# EAGLE design IRKitESP8266_v11 (EAGLE 8.4.3)
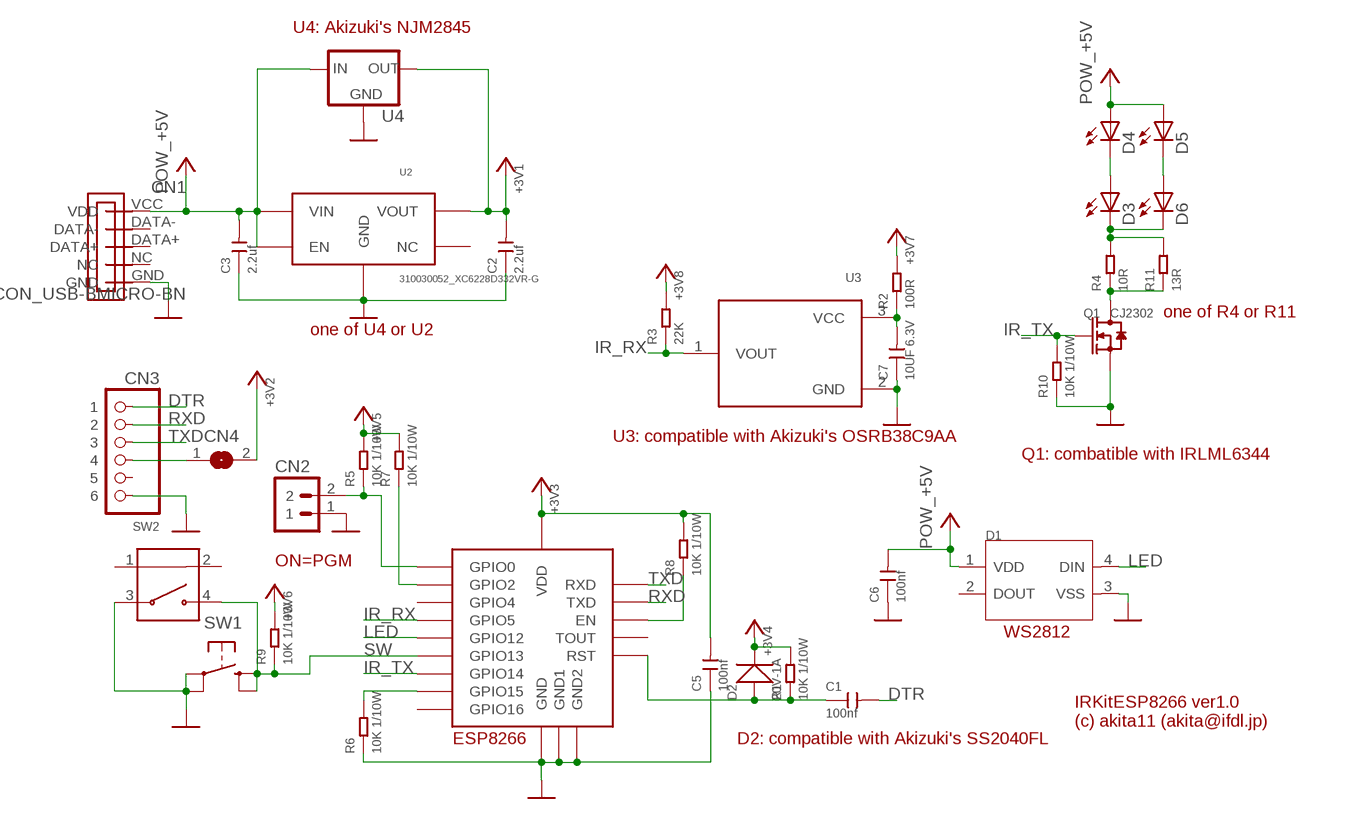
[diagram p0: schematic, sheet 1]

## Parts
C1  100nf  CERAMIC-100NF-50V-10%-X7R(0603)  [C0603]
C2  2.2uf  CERAMIC-2.2UF-10V-10%-X7R(0603)  [C0603]
C3  2.2uf  CERAMIC-2.2UF-10V-10%-X7R(0603)  [C0603]
C5  100nf  CERAMIC-100NF-50V-10%-X7R(0603)  [C0603]
C6  100nf  CERAMIC-100NF-50V-10%-X7R(0603)  [C0603]
C7  10UF 6.3V  CERAMIC-10UF-6.3V-20%-X5R(0603)  [C0603]
CN1  CON_USB-BMICRO-BN  [MICRO-USB_B_NARROW]
CN2  CON_PINHD-1X2PTH  [SPARKFUN_1X02]
CN3  CON_PINHD-1X6  [1X06]
CN4  JUMPER_SJ  [JUMPER_SJ]
D1  SMD-RGB-LED-4P'WS2812B'  [LED4-SMD-5050]
D2  20V-1A  SMD-DIODE-SCHOTTKY-20V-1A(SOD-123)  [SOD-123]
D3  LED5MM  [SPARKFUN_LED5MM]
D4  LED5MM  [SPARKFUN_LED5MM]
D5  LED5MM  [SPARKFUN_LED5MM]
D6  LED5MM  [SPARKFUN_LED5MM]
Q1  CJ2302  SMD-MOSFET-N-CH-20V-2.1A-CJ2302(SOT-23)  [SOT-23]
R1  10K 1/10W  SMD-RES-10K-5%-1/10W(0603)  [R0603]
R2  100R  SMD-RES-100R-5%-1/10W(0603)  [R0603]
R3  22K  SMD-RES-22K-5%-1/10W(0603)  [R0603]
R4  10R  SMD-RES-10R-1%-1/10W(0603)  [R0603]
R5  10K 1/10W  SMD-RES-10K-5%-1/10W(0603)  [R0603]
R6  10K 1/10W  SMD-RES-10K-5%-1/10W(0603)  [R0603]
R7  10K 1/10W  SMD-RES-10K-5%-1/10W(0603)  [R0603]
R8  10K 1/10W  SMD-RES-10K-5%-1/10W(0603)  [R0603]
R9  10K 1/10W  SMD-RES-10K-5%-1/10W(0603)  [R0603]
R10  10K 1/10W  SMD-RES-10K-5%-1/10W(0603)  [R0603]
R11  13R  SMD-RES-13R-5%-1/4W(1206)  [R1206]
SW1  SW_TACTTH  [SW_B3F-10XX]
SW2  TS-1188E  [TS-1188E]
U1  MOD_ESP8266WROOM02  [MOD_ESP8266WROOM02]
U2  310030052_XC6228D332VR-G  [SOT25J]
U3  TSOP382  [TSOP382]
U4  REG_78XXTO252-3  [TO-252-3]

## Nets
+3V3: C2.2 C5.2 CN4.2 D2.- R1.2 R2.2 R3.2 R5.2 R7.2 R8.2 R9.2 U1.P$1(VDD) U2.P$5(VOUT) U4.P$3(OUT) ; supply symbol labelled POW_+3V3
+5V: C3.2 C6.2 CN1.VCC(VDD) D1.1(VDD) D4.A D5.A U2.P$1(VIN) U2.P$3(EN) U4.P$1(IN) ; supply symbol labelled POW_+5V
DTR: C1.2 CN3.1
GND: C2.1 C3.1 C5.1 C6.1 C7.1 CN1.GND CN2.1 CN3.6 D1.3(VSS) Q1.2(S) R6.1 R10.1 SW1.3(P) SW1.4(P1) SW2.3 U1.P$9(GND) U1.P$13(GND1) U1.P$18(GND2) U2.P$2(GND) U3.2(GND) U4.P$2(GND) ; supply symbol labelled POW_GND
IR_RX: R3.1 U1.P$14(GPIO5) U3.1(VOUT)
IR_TX: Q1.1(G) R10.2 U1.P$3(GPIO14)
LED: D1.4(DIN) U1.P$4(GPIO12)
N$1: C1.1 D2.+ R1.1 U1.P$15(RST)
N$2: R6.2 U1.P$6(GPIO15)
N$3: CN2.2 R5.1 U1.P$8(GPIO0)
N$4: R7.1 U1.P$7(GPIO2)
N$5: CN3.4 CN4.1
N$6: R8.1 U1.P$2(EN)
N$7: C7.2 R2.1 U3.3(VCC)
N$9: Q1.3(D) R4.1 R11.1
N$10: D3.K(C) D6.K(C) R4.2 R11.2
N$11: D3.A D4.K(C)
N$12: D5.K(C) D6.A
RXD: CN3.2 U1.P$12(TXD)
SW: R9.1 SW1.1(S) SW1.2(S1) SW2.4 U1.P$5(GPIO13)
TXD: CN3.3 U1.P$11(RXD)
Unconnected: CN1.DATA+ CN1.DATA- CN1.NC CN3.5 D1.2(DOUT) SW2.1 SW2.2 U1.P$10(GPIO4) U1.P$16(TOUT) U1.P$17(GPIO16) U2.P$4(NC)

## Notes on the sheet
- U4: Akizuki's NJM2845
- one of R4 or R11
- one of U4 or U2
- U3: compatible with Akizuki's OSRB38C9AA
- Q1: combatible with IRLML6344
- ON=PGM
- WS2812
- IRKitESP8266 ver1.0
  (c) akita11 (akita@ifdl.jp)
- ESP8266 | D2: compatible with Akizuki's SS2040FL

## Library data of the parts
C1 C5 C6 = Seeed-Capacitor-2016:CERAMIC-100NF-50V-10%-X7R(0603): 302010138; MPN: CC0603KRX7R9BB104
C2 C3 = Seeed-Capacitor-2016:CERAMIC-2.2UF-10V-10%-X7R(0603): 302010054; MPN: CC0603KRX7R6BB225
C7 = Seeed-Capacitor-2016:CERAMIC-10UF-6.3V-20%-X5R(0603): 302010286; MPN: CC0603MRX5R5BB106
CN1 = akita:CON_USB-B
CN2 = akita:CON_PINHD-1X2: Header 2 Standard 2-pin 0.1" header. Use with straight break away headers (SKU : PRT-00116), right angle break away headers (PRT-00553), swiss pins (PRT-00743), machine pins (PRT-00117), and female headers (PRT-00115). Molex polarized connector foot print use with SKU : PRT-08233 with associated crimp pins and housings.
CN3 = akita:CON_PINHD-1X6: PIN HEADER
CN4 = akita:JUMPER_SJ: SMD solder JUMPER
D1 = Seeed-Diode-2016:SMD-RGB-LED-4P: 304990003
D2 = Seeed-Diode-2016:SMD-DIODE-SCHOTTKY-20V-1A(SOD-123): 304020034; MPN: B5819W
D3-D6 = akita:LED: LEDs Standard schematic elements and footprints for 5mm, 3mm, 1206, and 0603 sized LEDs. 5mm - Spark Fun Electronics SKU : COM-00529 (and others)
Q1 = Seeed-Transistor-2016:SMD-MOSFET-N-CH-20V-2.1A-CJ2302(SOT-23): 305030015; MPN: CJ2302
R1 R5-R10 = Seeed-Resistor-2016:SMD-RES-10K-5%-1/10W(0603): 301010293; MPN: RC0603JR-0710KL
R2 = Seeed-Resistor-2016:SMD-RES-100R-5%-1/10W(0603): 301010090; MPN: RC0603JR-07100RL
R3 = Seeed-Resistor-2016:SMD-RES-22K-5%-1/10W(0603): 301010132; MPN: RC0603JR-0722KL
R4 = Seeed-Resistor-2016:SMD-RES-10R-1%-1/10W(0603): 301010185; MPN: RC0603FR-0710RL
R11 = Seeed-Resistor-2016:SMD-RES-13R-5%-1/4W(1206): 301010405; MPN: RC1206JR-0713RL
SW1 = akita:SW_TACT: OMRON SWITCH; MPN: B3F-1000; OC_FARNELL: 176432; OC_NEWARK: 36M3542
SW2 = Seeed-OPL-2017-01-Switch-camilo:TS-1188E: 311020023
U1 = akita:MOD_ESP8266WROOM02
U2 = Seeed-OPL-2017-01-IC:310030052_XC6228D332VR-G: Torex;XC6228D332VR-G, SMD IC PMIC;SOT-25J, SKU: 310030052
U3 = Seeed-OPL-2017-01-Sensor-camilo:TSOP382: 314020013
U4 = akita:REG_78XX: Voltage Regulator Standard 7805 5V regulator. IGO (Input Ground Output). Spark Fun Electronics SKU : COM-00107

## Board
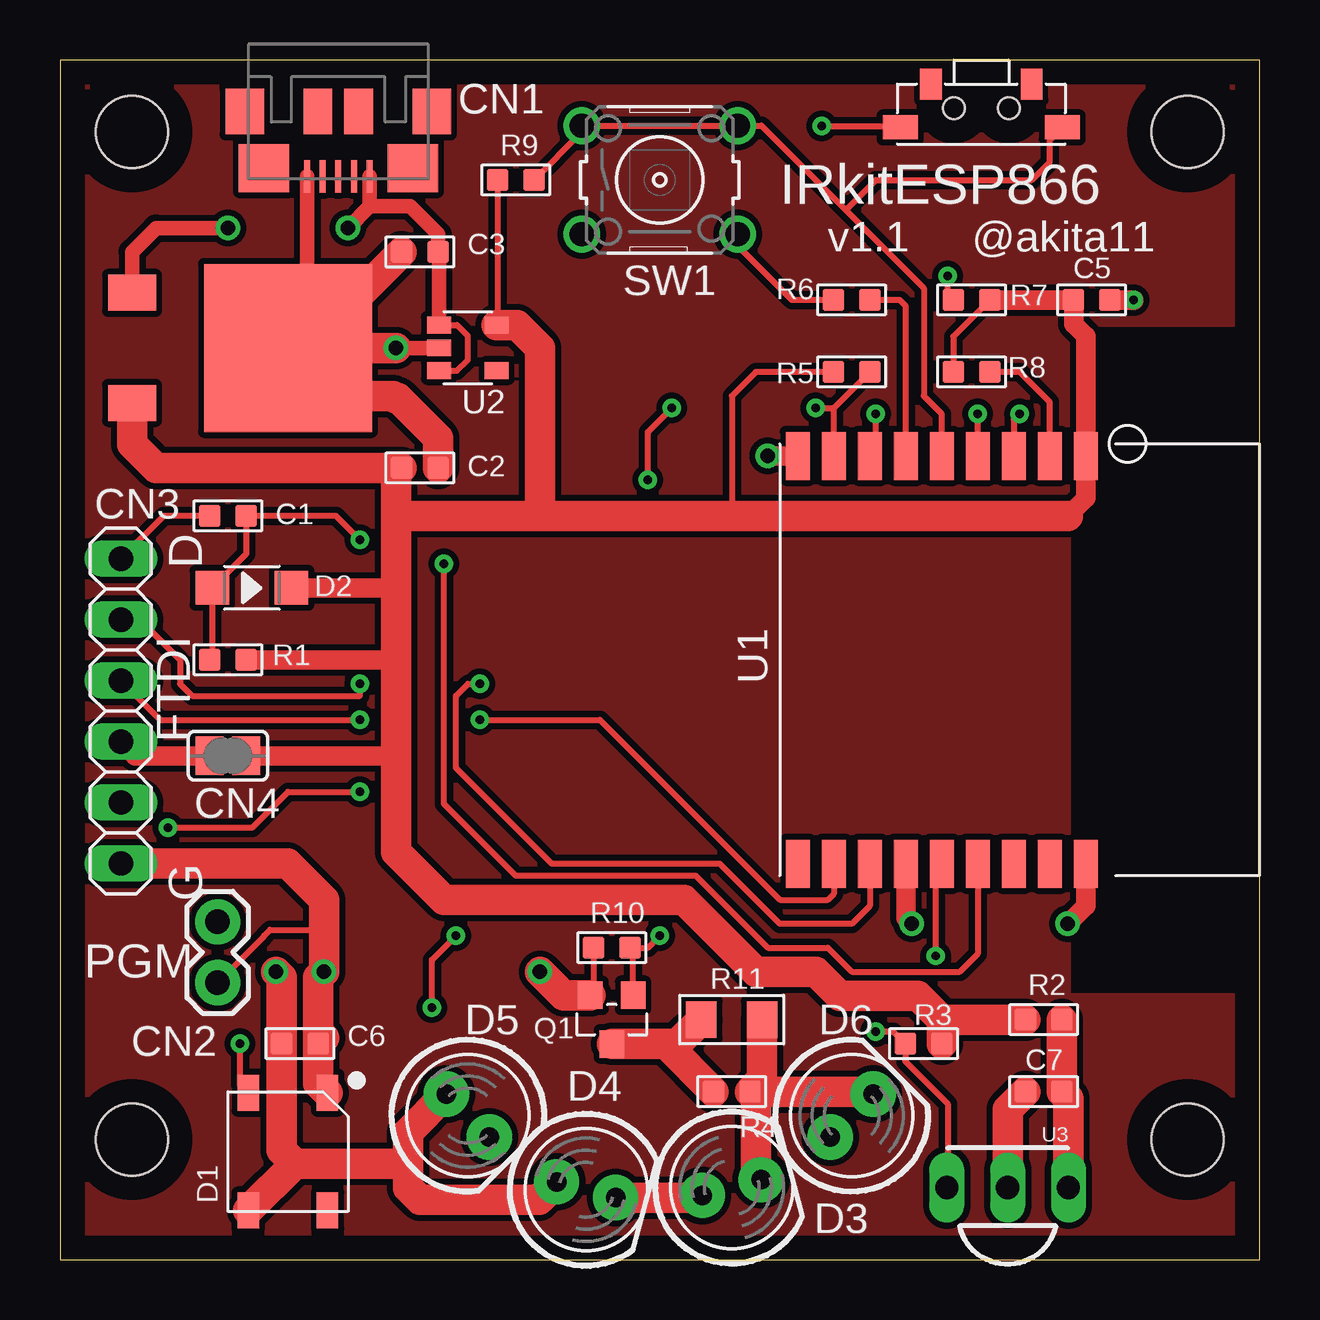
[diagram p1: board, top side]
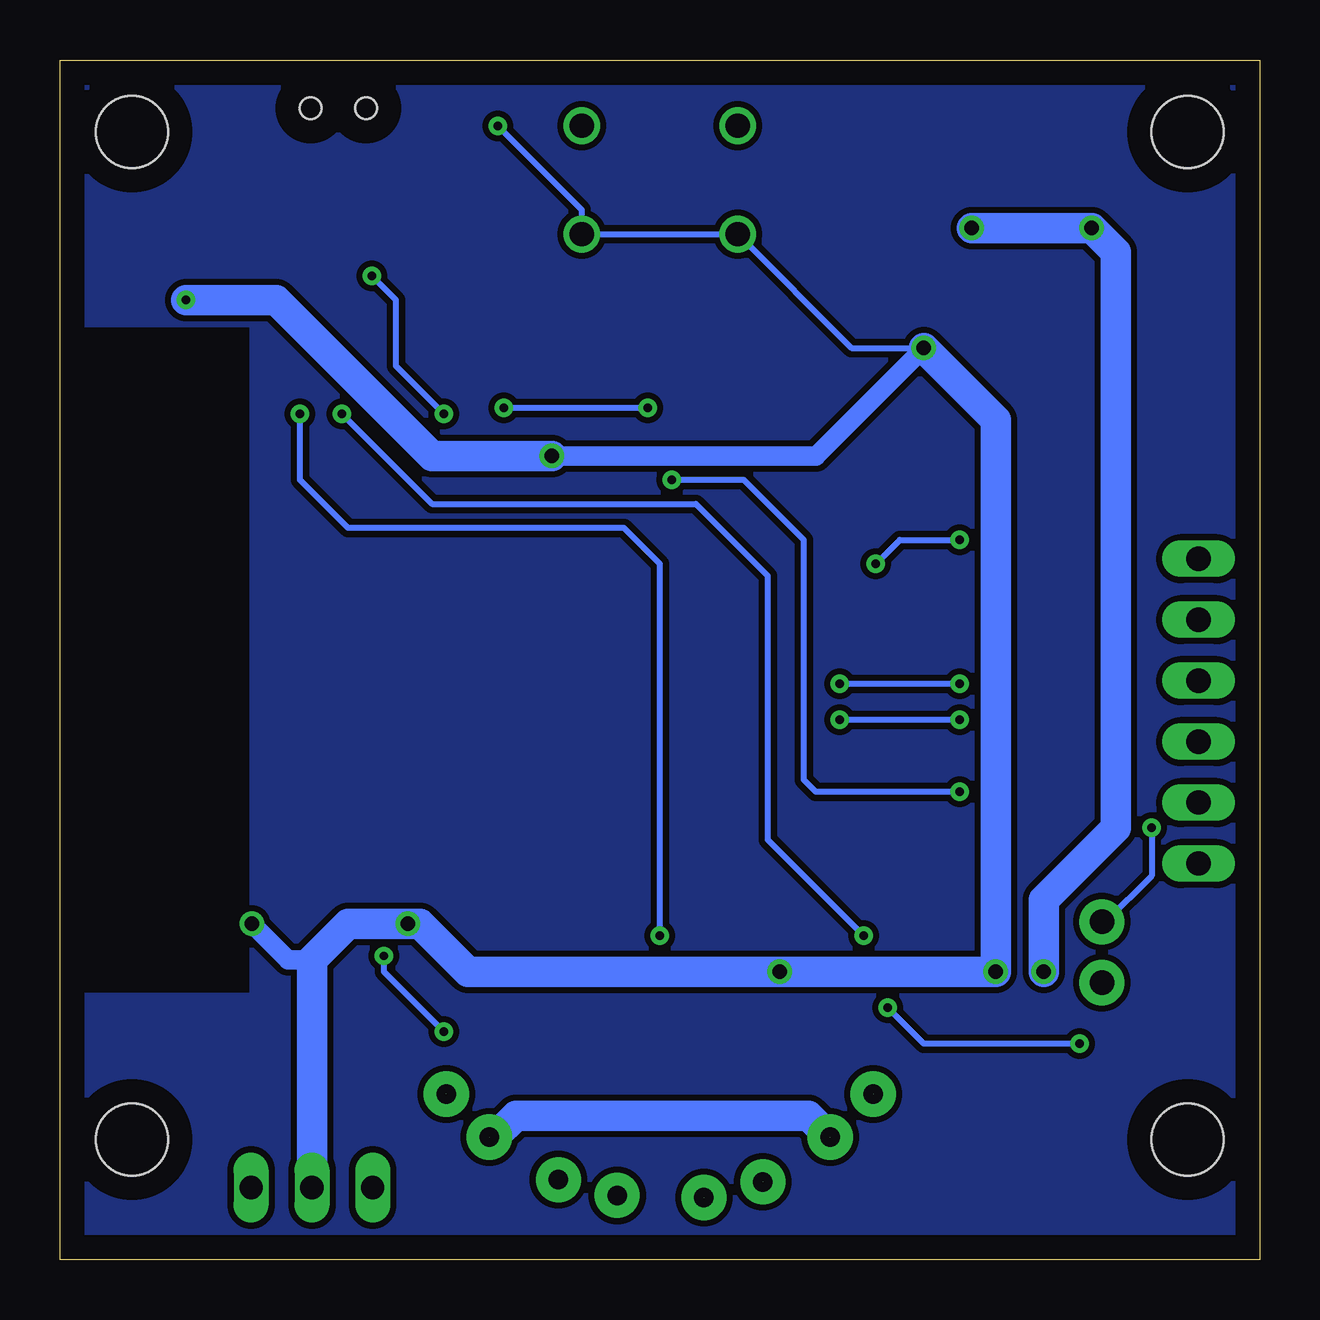
[diagram p2: board, bottom side, seen from below]

Size 50 x 50 mm. Coordinates in mm from the lower left corner, seen from the top.
Outline: 0,0 50,0 50,50 0,50 0,0
Copper layers (1*16): Top 0.035mm / dielectric 1.5mm / Bottom 0.035mm
Design rules "default": minimum track width 6mil, minimum drill 0.35mm, track to track 6mil, track to pad 6mil, pad to pad 6mil, via to via 6mil, smd to smd 6mil, copper to edge 40mil, drill to drill 6mil, minimum pad ring 10mil, minimum via ring 8mil, stop-mask expansion 4mil, vias tented up to drill 0mil, thermal gap 10mil
Holes 3 mm at 3,5 47,5 3,47 47,47

### Footprints (pad centres in the part's own frame; a part is rotated, then mirrored left to right if it is on the bottom)
C0603 = smd 0.889 x 0.889: 1 0,0.762; 2 0,-0.762
MICRO-USB_B_NARROW = smd 1.35 x 0.25: DATA+ -0.65,0; DATA- -0.65,0.65; GND -0.65,-1.3; NC -0.65,-0.65; VCC -0.65,1.3 | smd 1.9 x 1.6: P$1 -3.35,3.9; P$2 -3.35,-3.9 | smd 1.9 x 1.2: P$3 -3.35,0.85; P$4 -3.35,-0.85 | smd 2 x 2.1: P$6 -1,3.1; P$7 -1,-3.1
SPARKFUN_1X02 = drill 1.016 pad 1.88: 1 0,0; 2 2.54,0
1X06 = drill 1.016 long: 1 -6.35,0; 2 -3.81,0; 3 -1.27,0; 4 1.27,0; 5 3.81,0; 6 6.35,0
JUMPER_SJ = smd 1.168 x 1.6: 1 -0.762,0; 2 0.762,0
LED4-SMD-5050 = smd 1.5 x 0.9: 1 -2.45,1.65; 2 -2.45,-1.65; 3 2.45,-1.65; 4 2.45,1.65
SOD-123 = smd 1.397 x 1.397: + -1.651,0; - 1.651,0
SPARKFUN_LED5MM = drill 0.813 pad 1.88: A -1.27,0; K 1.27,0
SOT-23 = smd 1.016 x 1.143: 1 -0.889,-1.016; 2 0.889,-1.016; 3 0,1.016
R0603 = smd 0.889 x 0.889: 1 0,0.762; 2 0,-0.762
R1206 = smd 1.27 x 1.524: 1 -1.27,0; 2 1.27,0
SW_B3F-10XX = drill 1.016: 1 -3.251,2.261; 2 3.251,2.261; 3 -3.251,-2.261; 4 3.251,-2.261
TS-1188E = smd 0.9 x 1.3: 1 -2.1,1; 2 2.1,1 | smd 1.45 x 1: 3 -3.375,-0.8; 4 3.375,-0.8 | hole 0.9: -1.15,0; 1.15,0
MOD_ESP8266WROOM02 = smd 2 x 1: P$1 -8.5,2.75; P$2 -8.5,1.25; P$3 -8.5,-0.25; P$4 -8.5,-1.75; P$5 -8.5,-3.25; P$6 -8.5,-4.75; P$7 -8.5,-6.25; P$8 -8.5,-7.75; P$9 -8.5,-9.25; P$10 8.5,-9.25; P$11 8.5,-7.75; P$12 8.5,-6.25; P$13 8.5,-4.75; P$14 8.5,-3.25; P$15 8.5,-1.75; P$16 8.5,-0.25; P$17 8.5,1.25; P$18 8.5,2.75
SOT25J = smd 0.7 x 1: P$1 -0.95,-1.2; P$2 0,-1.2; P$3 0.95,-1.2; P$4 0.95,1.2; P$5 -0.95,1.2
TSOP382 = drill 0.96 long: 1 2.54,0; 2 0,0; 3 -2.54,0
TO-252-3 = smd 1.5 x 2: P$1 -2.3,-3; P$3 2.3,-3 | smd 7 x 7: P$2 0,3.5

### Placement (x,y rotation side)
C1  7,31 270 top
C2  15,33 270 top
C3  15,42 90 top
C5  43,40 270 top
C6  10,9 270 top
C7  41,7 90 top
CN1  11.6,44.5 270 top
CN2  6.57,11.54 90 top
CN3  2.54,22.86 270 top
CN4  7,21 0 top
D1  9.5,4.5 90 top
D2  8,28 0 top
D3  28,3 15 top
D4  21.93,2.91 345 top
D5  17,6 315 top
D6  33,6 45 top
Q1  23,10 180 top
R1  7,25 90 top
R2  41,10 270 top
R3  36,9 90 top
R4  28,7 90 top
R5  33,37 270 top
R6  33,40 90 top
R7  38,40 90 top
R8  38,37 270 top
R9  19,45 270 top
R10  23,13 90 top
R11  28,10 0 top
SW1  25,45 0 top
SW2  38.4,47.99 0 top
U1  40,25 270 top
U2  17,38 270 top
U3  39.5,3 180 top
U4  6,38 270 top

### Tracks (layer width: path | path; a pad name or v marks a point on that pad's centre or on a via)
+3V3
  Top 0.254: R8.2 37.24,38.48 R7.2 | R5.2 29,37 28,36 28,31 | R9.2 18.24,38.99 U2.P$5
  Top 0.813: 42,31 42.75,31.75 U1.P$1 42.75,38.5 42.25,39 42.25,39.99 C5.2 R7.2 | CN4.2 14,21 | D2.- 14,28 | R1.2 14,25
  Top 1.27: U4.P$3 3,34 4,33 C2.2 14,32.76 14,31 | 14,31 14,28 14,25 14,21 14,17 16,15 26,15 29,12 31.5,12 32.5,11 35.76,11 36.76,10 | 42,31 28,31 20,31 | 20,31 14,31 | U2.P$5 19.05,38.95 20,38 20,31 | R3.2 36.76,10 | R2.2 36.76,10
+5V  (via drill 0.6)  (2 unrouted)
  Top 0.254: U2.P$1 16.55,38.95 17,38.5 17,37.5 16.55,37.05 U2.P$3
  Top 0.61: CN1.VCC 12.9,43.9 | 12.9,43.9 v12,43 | U4.P$1 3,42 4,43 v7,43 | 12.9,43.9 14.6,43.9 15.76,42.74 C3.2 15.8,41.96 U2.P$1
  Top 1.27: D4.A 19.96,2.5 15,2.5 14.5,3 14.5,4 | D1.1 9.8,4 | 9.8,4 14.5,4 | v9,12 9.24,11.76 C6.2 9.24,4.56 9.8,4 | D5.A 14.5,5.3 14.5,4
  Bottom 1.27: v12,43 v7,43 6,42 6,18 9,15 v9,12
DTR
  Top 0.254: C1.2 4.33,31 CN3.1
GND  (via drill 0.35, 0.6)
  Top 0.254: U1.P$9 31,33.75 | R6.1 30.5,40 28.25,42.25 SW1.4 | R10.1 22.24,11.14 Q1.2 | v31.75,47.25 34.97,47.25 SW2.3 | CN2.1 8.5,13.47 8.5,13.5 8.75,13.75 11,13.75
  Top 0.61: U2.P$2 v14,38 | CN1.GND 10.3,38.06 10.24,38
  Top 0.813: U1.P$9 v29.5,33.5 | U1.P$13 35.25,14.25 v35.5,14 | U1.P$18 42.75,14.75 v42,14 | C5.1 v44.75,40
  Top 1.27: C2.1 15.76,34.24 14.09,35.91 13.97,35.91 13.89,36 9.5,36 U4.P$2 10.24,38 | C3.1 10.24,38 | v14,38 10.24,38 | U3.2 39.5,6.26 C7.1 | D1.3 10.76,7.34 C6.1 | C6.1 11,9.24 | Q1.2 20.98,11.02 v20,12 | C6.1 10.76,11.76 v11,12 11,13.75 11,15 9.49,16.51 CN3.6
  Bottom 0.254: v14,38 17.01,38 SW1.3 SW1.4 28.25,43.75 v31.75,47.25
  Bottom 0.813: v29.5,33.5 18.5,33.5 v14,38 | v42,14 40.5,12.5 39.5,12.5
  Bottom 1.27: v14,38 11,35 v11,12 v20,12 33,12 35,14 v35.5,14 38,14 39.5,12.5 U3.2 | v29.5,33.5 34.5,33.5 41,40 v44.75,40
IR_RX  (via drill 0.35)
  Top 0.254: U3.1 37,3.04 37,6.5 35.24,8.26 R3.1 34.74,9.5 v34,9.5 | v36.5,12.66 36.5,16.25 U1.P$14
  Bottom 0.254: v34,9.5 36.5,12 v36.5,12.66
IR_TX  (via drill 0.35)
  Top 0.254: Q1.1 23.89,12.87 R10.2 24.5,13 v25,13.5 | v40,35.25 39.75,35 U1.P$3
  Bottom 0.254: v25,13.5 25,29 26.5,30.5 38,30.5 40,32.5 v40,35.25
LED  (via drill 0.35)
  Top 0.254: U1.P$4 v38.25,35.25 | D1.4 7.5,7.3 v7.5,9 | v15.5,10.5 15.5,12.5 v16.5,13.5
  Bottom 0.254: v38.25,35.25 34.5,31.5 23.5,31.5 20.5,28.5 20.5,17.5 v16.5,13.5 | v15.5,10.5 14,9 v7.5,9
N$1  (via drill 0.35)
  Top 0.254: R1.1 6.35,25.11 D2.+ 7.76,29.41 C1.1 11.5,31 v12.5,30 | U1.P$15 38.25,12.75 37.5,12 33,12 32,13 29.5,13 26.5,16 19,16 16,19 v16,29
  Bottom 0.254: v16,29 15,30 v12.5,30
N$2
  Top 0.254: U1.P$6 35.25,39.75 35,40 R6.2
N$3  (via drill 0.35)
  Top 0.254: 32.24,33.51 U1.P$8 32.25,35.49 | 32.25,35.49 R5.1 | v4.5,18 8,18 9.5,19.5 v12.5,19.5 | v24.5,32.5 24.5,34.5 v25.5,35.5 | v31.5,35.5 32.24,35.5 32.25,35.49
  Bottom 0.254: v12.5,19.5 18.5,19.5 19,20 19,30 21.5,32.5 v24.5,32.5 | v25.5,35.5 v31.5,35.5 | v4.5,18 4.5,16 6.42,14.08 CN2.2
N$4  (via drill 0.35)
  Top 0.254: U1.P$7 34,33.75 v34,35.25 | R7.1 37,40.24 v37,41
  Bottom 0.254: v34,35.25 36,37.25 36,40 v37,41
N$5
  Top 0.813: CN3.4 3.13,21 CN4.1
N$6
  Top 0.254: U1.P$2 41.25,35.75 40,37 R8.1
N$7
  Top 1.27: U3.3 42.04,6.72 C7.2 R2.1
N$8
  pour Top (isolate 0.254): 0,50 50,50 50,39 42,39 42,11 50,11 50,0 0,0
N$9
  Top 1.27: Q1.3 25.25,8.98 | 25.25,8.98 R4.1 | R11.1 25.71,8.98 25.25,8.98
N$10  (1 unrouted)
  Top 1.27: 33.9,7.1 D6.K 33.8,7 29,7 | R11.2 29.27,7.51 R4.2 29,7 | D3.K 29,3.56 29,7
N$11  (1 unrouted)
  Top 1.27: D4.K 26.68,2.58 D3.A
N$12  (2 unrouted)
  Bottom 1.27: D5.K 18.8,6 31,6 31.9,5.1 D6.A
N$13
  pour Bottom (isolate 0.254): 0,50 50,50 50,39 42,39 42,11 50,11 50,0 0,0
RXD  (via drill 0.35)
  Top 0.254: CN3.2 3.33,26.67 5,25 5,24 5.5,23.5 12.5,23.5 v12.5,24 | U1.P$12 33.75,14.75 33,14 30,14 28,16 27.5,16.5 20.5,16.5 16.5,20.5 16.5,23.5 17,24 v17.5,24
  Bottom 0.254: v12.5,24 v17.5,24
SW
  Top 0.254: U1.P$5 36.75,35.25 36,36 36,40.5 32.75,43.75 | 19.76,44.73 R9.1 21.75,46.99 SW1.1 SW1.2 29.24,47.26 32.75,43.75 | 32.75,43.75 34,45 40.5,45 41.25,45.75 41.25,46.66 SW2.4
TXD  (via drill 0.35)
  Top 0.254: CN3.3 4.17,22.5 v12.5,22.5 | U1.P$11 32.25,15.25 32,15 30,15 22.5,22.5 v17.5,22.5
  Bottom 0.254: v12.5,22.5 v17.5,22.5

### Text on the board
tPlace: IRkitESP866 | v1.1 | @akita11 | D | FTDI | G | PGM